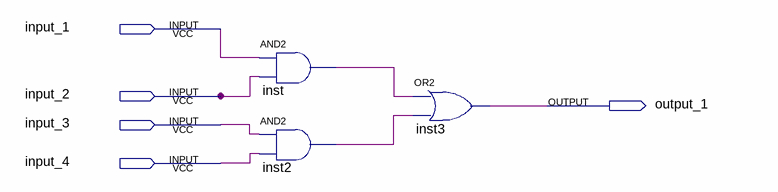
[diagram p0: schematic sheet]
// Quartus schematic lab02.bdf as structural Verilog: 3 symbols, 5 pins
module lab02 (
  input  input_1,
  input  input_2,
  input  input_3,
  input  input_4,
  output output_1
);

  wire inst2_out, inst_out;

  and inst (inst_out, input_1, input_2);
  and inst2 (inst2_out, input_3, input_4);
  or inst3 (output_1, inst_out, inst2_out);
endmodule
